# EAGLE design v001 (EAGLE 6.4)
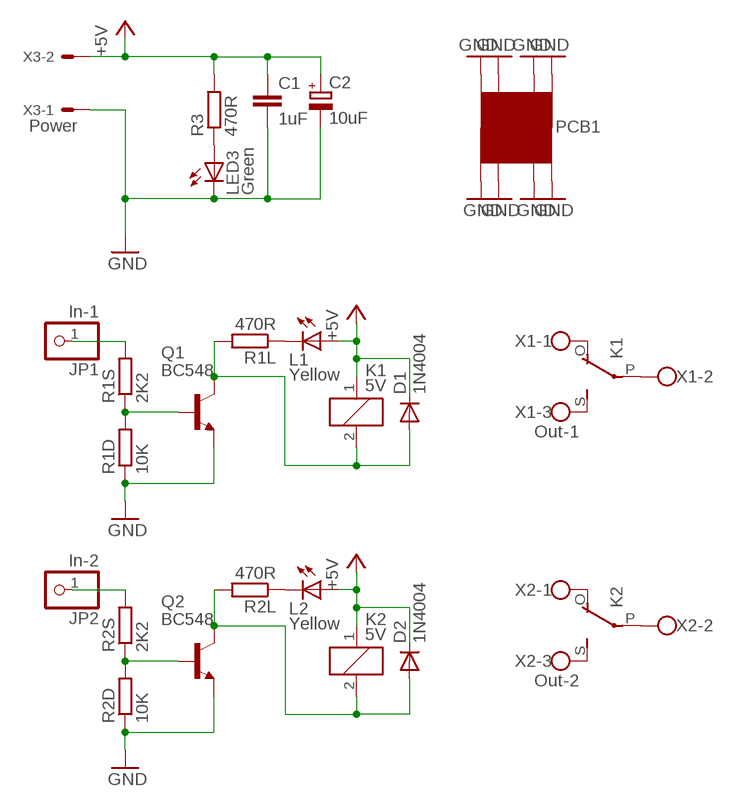
[diagram p0: schematic, sheet 1]

## Parts
C1  1uF  C-EU050-035X075  [C050-035X075]
C2  10uF  CPOL-EUE2.5-5  [E2,5-5]
D1  1N4004  [DO41-10]
D2  1N4004  [DO41-10]
JP1  In-1  PINHD-1X1  [1X01]
JP2  In-2  PINHD-1X1  [1X01]
K1  5V  G5L  [G5LE]
K2  5V  G5L  [G5LE]
L1  Yellow  LED3MM  [LED3MM]
L2  Yellow  LED3MM  [LED3MM]
LED3  Green  LED3MM  [LED3MM]
PCB1  PCB05X05  [PCB_05X05]
Q1  BC548  [TO92-EBC]
Q2  BC548  [TO92-EBC]
R1D  10K  R-EU_0204/7  [0204/7]
R1L  470R  R-EU_0204/7  [0204/7]
R1S  2K2  R-EU_0204/7  [0204/7]
R2D  10K  R-EU_0204/7  [0204/7]
R2L  470R  R-EU_0204/7  [0204/7]
R2S  2K2  R-EU_0204/7  [0204/7]
R3  470R  R-EU_0207/2V  [0207/2V]
X1  Out-1  W237-103  [W237-103]
X2  Out-2  W237-103  [W237-103]
X3  Power  22-27-2021-02  [6410-02]

## Nets
+5V: C1.1 C2.+ D1.C D2.C K1.1 K2.1 L1.A L2.A R3.2 X3.2
GND: C1.2 C2.- LED3.K(C) PCB1.GND@1(GND) PCB1.GND@2(GND) PCB1.GND@3(GND) PCB1.GND@4(GND) PCB1.GND@5(GND) PCB1.GND@6(GND) PCB1.GND@7(GND) PCB1.GND@8(GND) Q1.E Q2.E R1D.1 R2D.1 X3.1
N$1: K1.P(2:P) X1.2
N$2: K1.O(2:O) X1.1
N$3: K1.S(2:S) X1.3
N$4: Q2.B R2D.2 R2S.1
N$5: JP2.1 R2S.2
N$6: D2.A K2.2 Q2.C R2L.2
N$7: L2.K(C) R2L.1
N$8: K2.P(2:P) X2.2
N$9: K2.S(2:S) X2.3
N$10: K2.O(2:O) X2.1
N$11: D1.A K1.2 Q1.C R1L.2
N$14: Q1.B R1D.2 R1S.1
N$15: JP1.1 R1S.2
N$17: L1.K(C) R1L.1
N$20: LED3.A R3.1

## Library data of the parts
C1 = rcl:C-EU: CAPACITOR, European symbol
C2 = rcl:CPOL-EU: POLARIZED CAPACITOR, European symbol
D1 D2 = diode:1N4004: DIODE general purpose rectifier, 1 A
JP1 JP2 = pinhead:PINHD-1X1: PIN HEADER
K1 K2 = relay:G5L: RELAY 1 x switch, 10 A/120 V AC, 8 A/30 V ADC, Omron; OC_FARNELL: unknown; OC_NEWARK: unknown
L1 L2 LED3 = led:LED: LED OSRAM: - CHIPLED LG R971, LG N971, LY N971, LG Q971, LY Q971, LO R971, LY R971 LH N974, LH R974 LS Q976, LO Q976, LY Q976 LO Q996 - Hyper CHIPLED LW Q18S LB Q993, LB Q99A, LB R99A - SideLED LS A670, LO A670, LY A670, LG A670, LP A670 LB A673, LV A673, LT A673, LW A673 LH A674 LY A675 LS A676, LA A676, LO A676, LY A676, LW A676 LS A679, LY A679, LG A679 - Hyper Micro SIDELED® LS Y876, LA Y876, LO Y876, LY Y876 LT Y87S - SmartLED LW L88C, LW L88S LB L89C, LB L89S, LG L890 LS L89K, LO L89K, LY L89K LS L896, LA L896, LO L896, LY L896 - TOPLED LS T670, LO T670, LY T670, LG T670, LP T670 LSG T670, LSP T670, LSY T670, LOP T670, LYG T670 LG T671, LOG T671, LSG T671 LB T673, LV T673, LT T673, LW T673 LH T674 LS T676, LA T676, LO T676, LY T676, LB T676, LH T676, LSB T676, LW T676 LB T67C, LV T67C, LT T67C, LS T67K, LO T67K, LY T67K, LW E67C LS E67B, LA E67B, LO E67B, LY E67B, LB E67C, LV E67C, LT E67C LW T67C LS T679, LY T679, LG T679 LS T770, LO T770, LY T770, LG T770, LP T770 LB T773, LV T773, LT T773, LW T773 LH T774 LS E675, LA E675, LY E675, LS T675 LS T776, LA T776, LO T776, LY T776, LB T776 LHGB T686 LT T68C, LB T68C - Hyper Mini TOPLED® LB M676 - Mini TOPLED Santana® LG M470 LS M47K, LO M47K, LY M47K Source: http://www.osram.convergy.de LUXEON: - LUMILED® LXK2-PW12-R00, LXK2-PW12-S00, LXK2-PW14-U00, LXK2-PW14-V00 LXK2-PM12-R00, LXK2-PM12-S00, LXK2-PM14-U00 LXK2-PE12-Q00, LXK2-PE12-R00, LXK2-PE12-S00, LXK2-PE14-T00, LXK2-PE14-U00 LXK2-PB12-K00, LXK2-PB12-L00, LXK2-PB12-M00, LXK2-PB14-N00, LXK2-PB14-P00, LXK2-PB14-Q00 LXK2-PR12-L00, LXK2-PR12-M00, LXK2-PR14-Q00, LXK2-PR14-R00 LXK2-PD12-Q00, LXK2-PD12-R00, LXK2-PD12-S00 LXK2-PH12-R00, LXK2-PH12-S00 LXK2-PL12-P00, LXK2-PL12-Q00, LXK2-PL12-R00 Source: www.luxeon.com KINGBRIGHT: KA-3528ASYC Source: www.kingbright.com
PCB1 = GNLib:PCB
Q1 Q2 = transistor-npn:BC548*: NPN Transistor
R1D R1L R1S R2D R2L R2S = rcl:R-EU_: RESISTOR, European symbol
R3 = resistor:R-EU_: RESISTOR, European symbol
X1 X2 = con-wago-500:W237-103: WAGO SCREW CLAMP; MPN: 237-103; OC_FARNELL: unknown; OC_NEWARK: 18M7116
X3 = con-molex:22-?-02: CONNECTOR wire to board 2.54 mm (.1 inch) pitch header; OC_FARNELL: unknown; OC_NEWARK: unknown

## Board
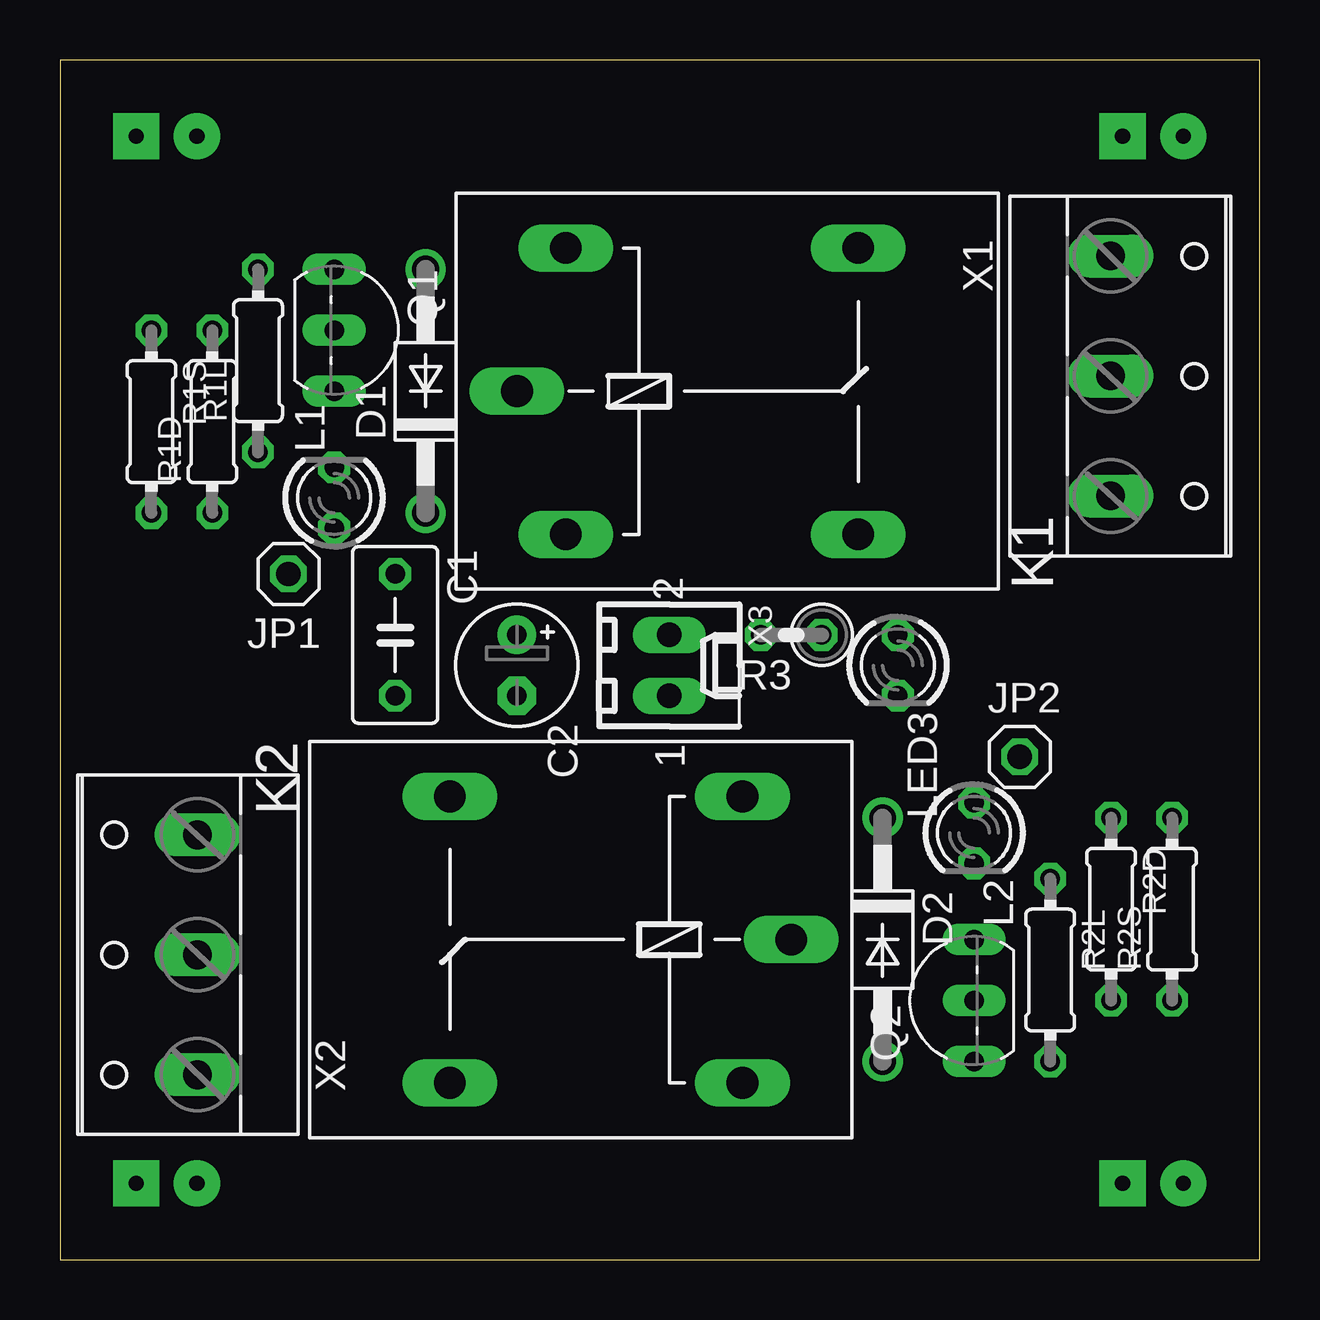
[diagram p1: board, top side]
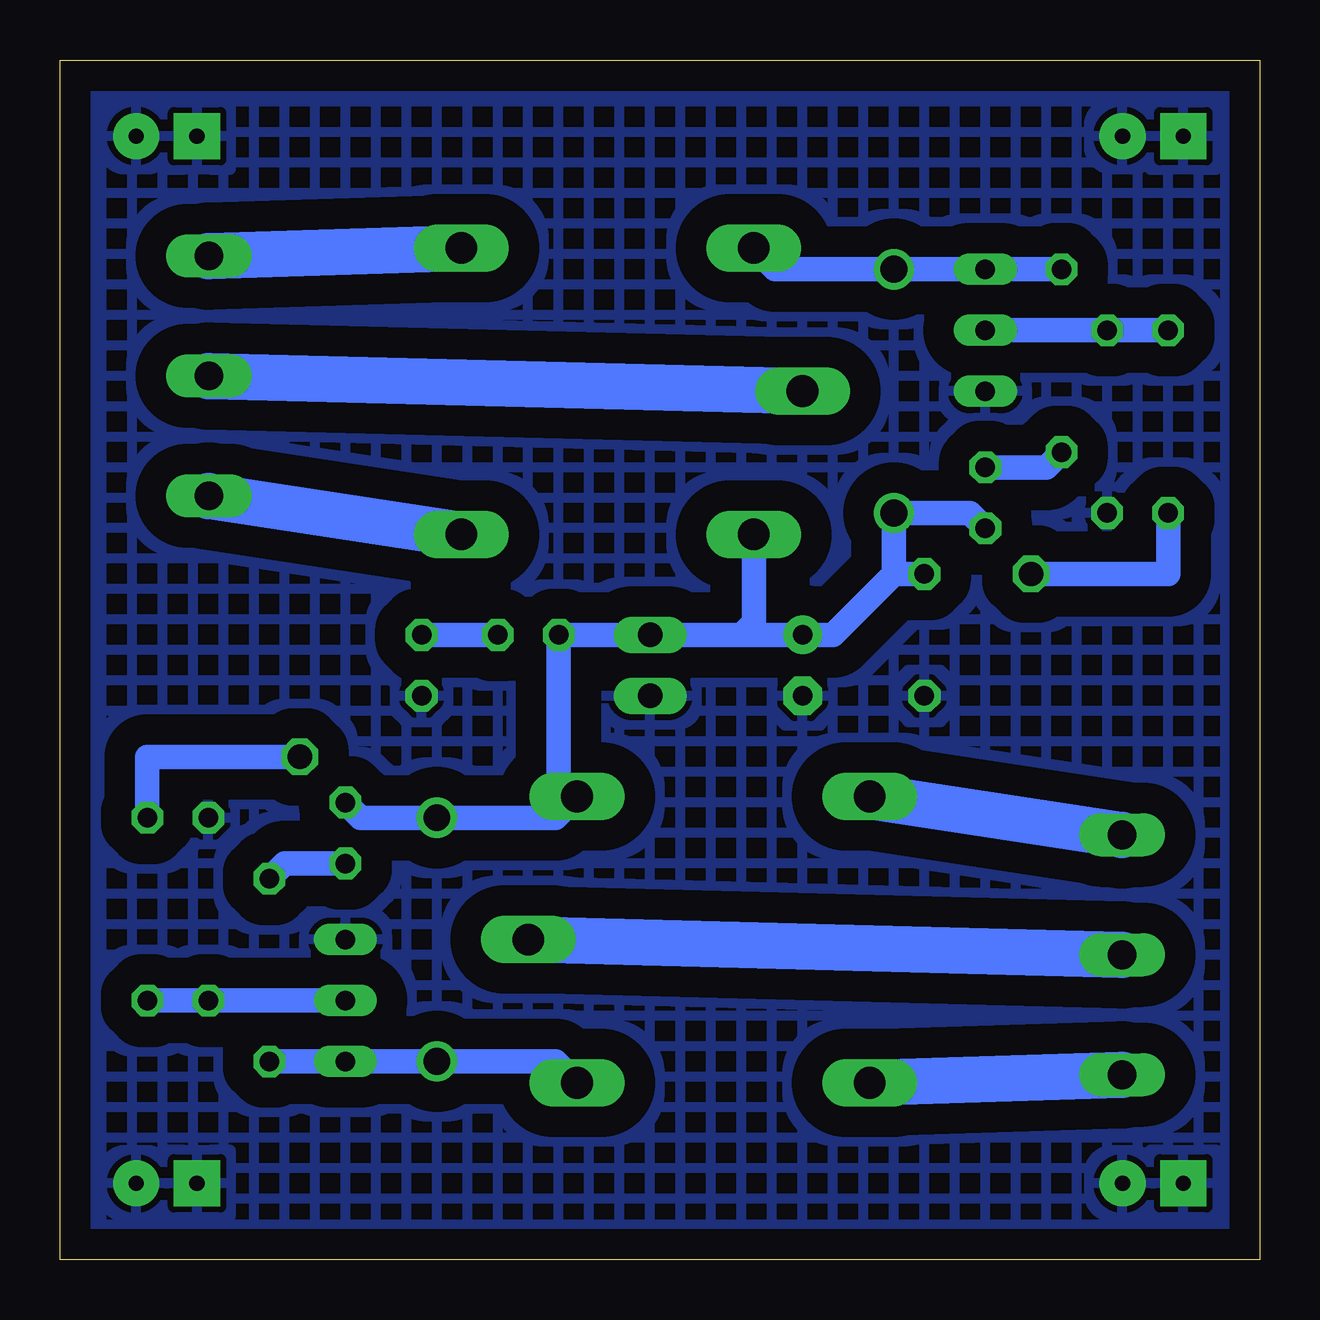
[diagram p2: board, bottom side, seen from below]

Size 50 x 50 mm. Coordinates in mm from the lower left corner, seen from the top.
Outline: 0,0 50,0 50,50 0,50 0,0
Copper layers (1*16): Top 0.035mm / dielectric 1.5mm / Bottom 0.035mm
Design rules "default": minimum track width 10mil, minimum drill 24mil, track to track 8mil, track to pad 8mil, pad to pad 8mil, via to via 8mil, smd to smd 8mil, copper to edge 40mil, drill to drill 8mil, minimum pad ring 10mil, minimum via ring 8mil, stop-mask expansion 4mil, vias tented up to drill 0mil, thermal gap 10mil

### Footprints (pad centres in the part's own frame; a part is rotated, then mirrored left to right if it is on the bottom)
C050-035X075 = drill 0.813 octagon: 1 -2.54,0; 2 2.54,0
E2,5-5 = drill 0.813 pad 1.6: + -1.27,0 | drill 0.813 pad 1.6 octagon: - 1.27,0
DO41-10 = drill 1.118: A 5.08,0; C -5.08,0
1X01 = drill 1.016 octagon: 1 0,0
G5LE = drill 1.321 long: 1 -7.493,-5.969; 2 -7.493,5.969; O 4.699,5.969; P -9.525,0; S 4.699,-5.969
LED3MM = drill 0.813 octagon: A -1.27,0; K 1.27,0
PCB_05X05 = drill 0.64 pad 1.93 square: GND@1 3.175,46.825; GND@2 44.285,46.825; GND@7 3.175,3.175; GND@8 44.285,3.175 | drill 0.64 pad 1.93: GND@3 46.825,46.825; GND@4 5.715,46.825; GND@5 46.825,3.175; GND@6 5.715,3.175
TO92-EBC = drill 0.813 long: B 0,-1.27; C -2.54,-1.27; E 2.54,-1.27
0204/7 = drill 0.813 octagon: 1 -3.81,0; 2 3.81,0
0207/2V = drill 0.813 octagon: 1 -1.27,0; 2 1.27,0
W237-103 = drill 1.194 long: 1 -5,-1.29; 2 0,-1.29; 3 5,-1.29
6410-02 = drill 1.016 long: 1 1.27,0; 2 -1.27,0

### Placement (x,y rotation side)
C1  13.97,26.04 270 top
C2  19.05,24.77 270 top
D1  15.24,36.2 90 top
D2  34.29,13.34 270 top
JP1  9.53,28.57 180 top
JP2  40.01,20.95 0 top
K1  28.57,36.2 0 top
K2  20.95,13.34 180 top
L1  11.43,31.75 90 top
L2  38.1,17.78 270 top
LED3  34.92,24.77 270 top
PCB1  0,0 0 top
Q1  12.7,38.73 270 top
Q2  36.83,10.79 90 top
R1D  6.35,34.92 90 top
R1L  8.26,37.47 90 top
R1S  3.81,34.92 270 top
R2D  43.81,14.61 270 top
R2L  41.27,12.06 270 top
R2S  46.35,14.61 90 top
R3  30.48,26.04 180 top
X1  45.09,36.83 270 top
X2  4.45,12.7 90 top
X3  25.4,24.77 270 top

### Tracks (layer width: path | path; a pad name or v marks a point on that pad's centre or on a via)
+5V
  Bottom 1.016: L1.A 12.06,31.11 D1.C 15.24,28.57 | 21.59,26.04 X3.2 R3.2 29.21,20.07 K2.1 29.34,18.41 D2.C 37.47,18.41 L2.A | 21.59,26.04 C2.+ 17.78,26.04 15.24,28.57 | K1.1 21.08,26.54 21.59,26.04 | 15.24,28.57 C1.1
GND
  pour Bottom (isolate 1.27, hatched): 50.16,50.16 0,50.16 0,21.59 0,5.08 0,0 50.16,0 50.16,27.94
N$1
  Bottom 1.93: X1.2 K1.P
N$2
  Bottom 1.93: K1.O X1.1
N$3
  Bottom 1.93: K1.S X1.3
N$4
  Bottom 1.016: R2S.1 R2D.2 Q2.B
N$5
  Bottom 1.016: R2S.2 46.35,20.95 JP2.1
N$6
  Bottom 1.016: K2.2 29.34,8.26 D2.A Q2.C R2L.2
N$7
  Bottom 1.016: R2L.1 40.64,16.51 L2.K
N$8
  Bottom 1.93: X2.2 K2.P
N$9
  Bottom 1.93: K2.S X2.3
N$10
  Bottom 1.93: K2.O X2.1
N$11
  Bottom 1.016: K1.2 20.19,41.27 D1.A Q1.C R1L.2
N$14
  Bottom 1.016: Q1.B R1D.2 R1S.1
N$15
  Bottom 1.016: R1S.2 3.81,28.57 JP1.1
N$17
  Bottom 1.016: R1L.1 8.89,33.02 L1.K
N$20
  Bottom 1.016: R3.1 LED3.A